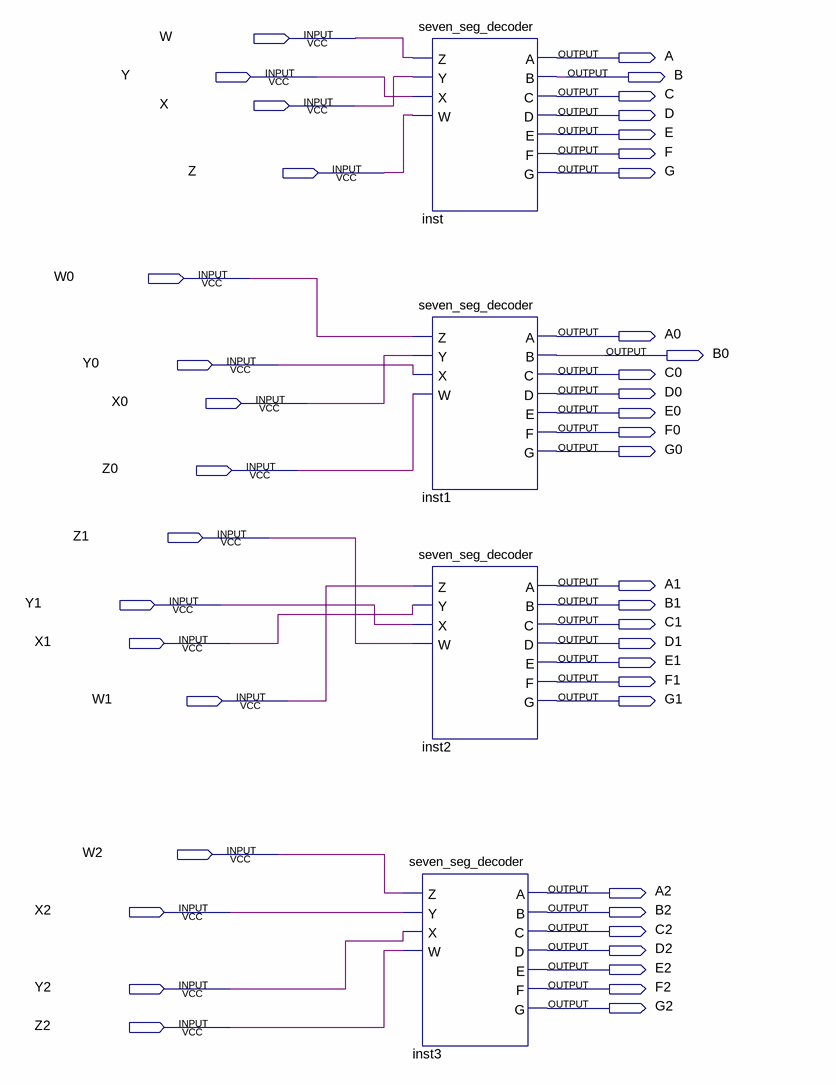
[diagram p0: schematic sheet]
// Quartus schematic lab5step1.bdf as structural Verilog: 4 symbols, 44 pins
module lab5step1 (
  input  W,
  input  Y,
  input  X,
  input  Z,
  input  W0,
  input  Y0,
  input  X0,
  input  Z0,
  input  Z1,
  input  Y1,
  input  X1,
  input  W1,
  input  W2,
  input  X2,
  input  Y2,
  input  Z2,
  output A,
  output B,
  output C,
  output D,
  output E,
  output F,
  output G,
  output A0,
  output B0,
  output C0,
  output D0,
  output E0,
  output F0,
  output G0,
  output A1,
  output B1,
  output C1,
  output D1,
  output E1,
  output F1,
  output G1,
  output A2,
  output B2,
  output C2,
  output D2,
  output E2,
  output F2,
  output G2
);

  seven_seg_decoder inst (.Z(W), .Y(X), .X(Y), .W(Z), .A(A), .B(B), .C(C), .D(D), .E(E), .F(F), .G(G));
  seven_seg_decoder inst1 (.Z(W0), .Y(X0), .X(Y0), .W(Z0), .A(A0), .B(B0), .C(C0), .D(D0), .E(E0), .F(F0), .G(G0));
  seven_seg_decoder inst2 (.Z(W1), .Y(X1), .X(Y1), .W(Z1), .A(A1), .B(B1), .C(C1), .D(D1), .E(E1), .F(F1), .G(G1));
  seven_seg_decoder inst3 (.Z(W2), .Y(X2), .X(Y2), .W(Z2), .A(A2), .B(B2), .C(C2), .D(D2), .E(E2), .F(F2), .G(G2));
endmodule
